# Altium schematic sheet MM32_Class_board_V2.0.SchDoc
size A3
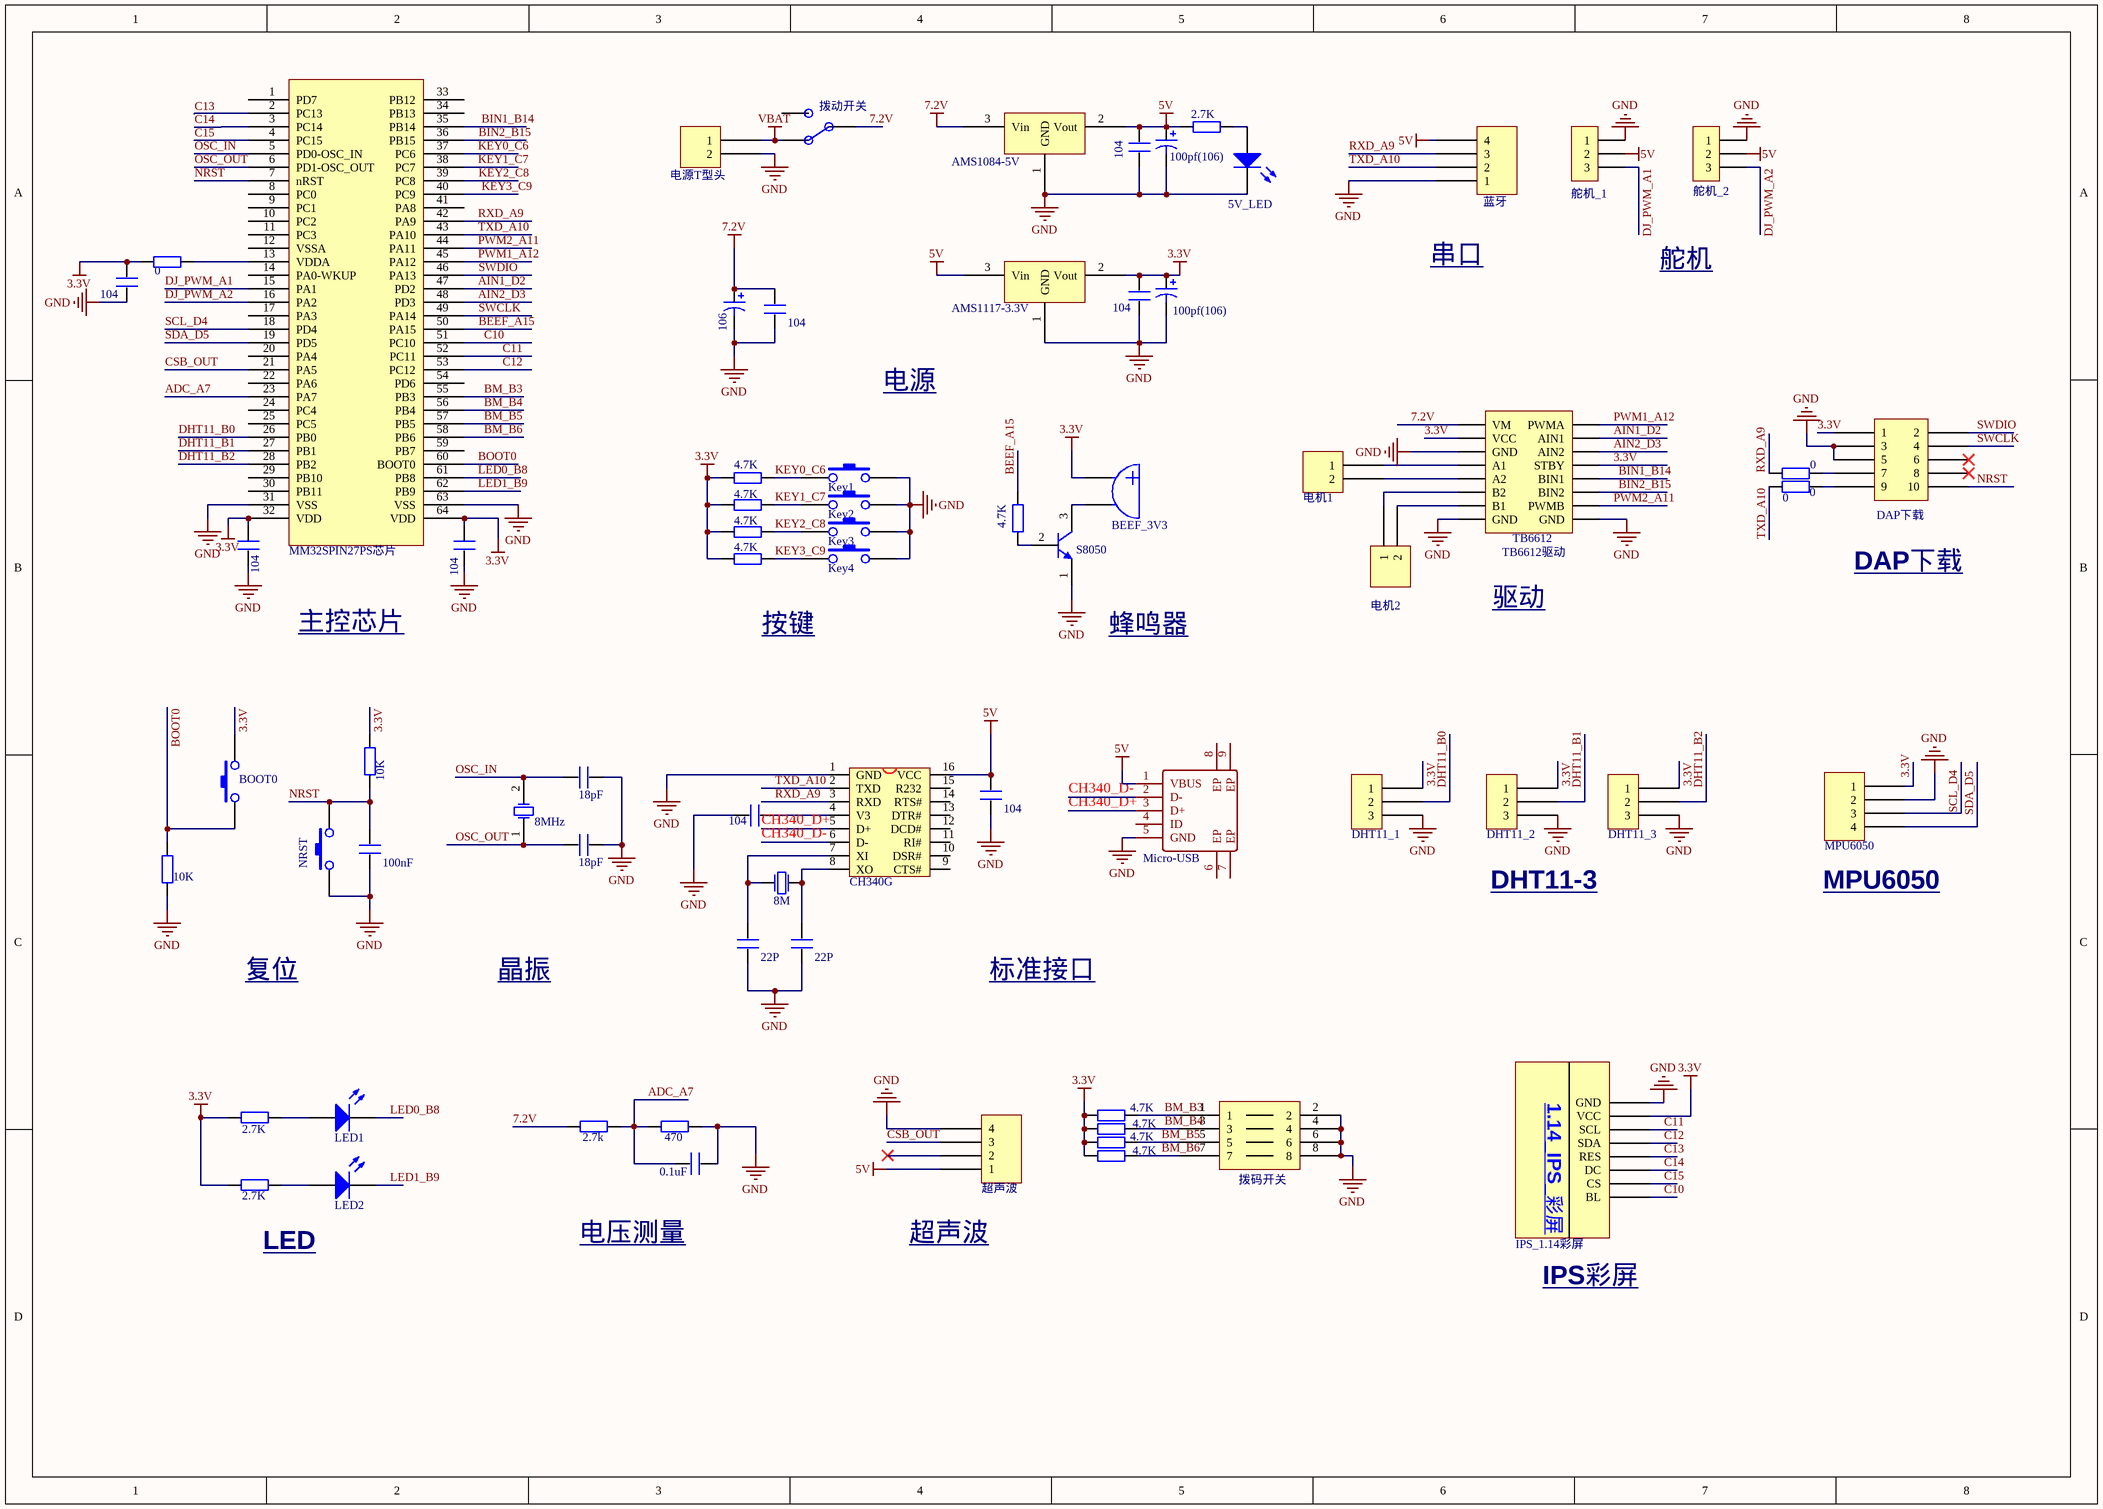
[diagram p0: MM32_Class_board_V2.0.SchDoc]

## Parts
6050  MPU6050  [四脚插座]
*1  IPS_1.14彩屏  [1.14_IPS]
A1  AMS1117-3.3V  [AMS1117]
A2  AMS1084-5V  [AMS1086]
B1  BEEF_3V3  [BEEF_3V3]
BOOT0  BOOT0  [贴片按键]
C1  104  [电容0805]
C2  100pf(106)  [钽电容1206]
C3  104  [电容0805]
C4  104  [电容0805]
C5  100pf(106)  [钽电容1206]
C6  106  [钽电容1206]
C7  104  [电容0805]
C8  104  [电容0805]
C9  104  [电容0805]
C10  18pF  [电容0805]
C11  104  [电容0805]
C12  104  [电容0805]
C13  18pF  [电容0805]
C15  22P  [电容0805]
C16  22P  [电容0805]
C17  0.1uF  [电容0805]
D1  5V_LED  [LED贴片]
D2  LED1  [LED贴片]
D3  LED2  [LED贴片]
DAP下载  DAP下载  [P5X2]
K_C6  Key1  [贴片按键]
K_C7  Key2  [贴片按键]
K_C8  Key3  [贴片按键]
K_C9  Key4  [贴片按键]
M1  Micro-USB  [Micro-USB]
OS1  8M  [晶振]
P4  DHT11_1  [三脚插座]
P5  DHT11_2  [三脚插座]
P6  DHT11_3  [三脚插座]
PA1  电机1  [电源插座1]
PA2  电机2  [电源插座1]
PB1  电源T型头  [电源插座2]
Q1  S8050  [NPN8050]
R1  2.7K  [电阻0805]
R2  0  [电阻0805]
R3  4.7K  [电阻0805]
R4  4.7K  [电阻0805]
R5  4.7K  [电阻0805]
R6  4.7K  [电阻0805]
R7  4.7K  [电阻0805]
R8  10K  [电阻0805]
R9  10K  [电阻0805]
R10  0  [电阻0805]
R11  0  [电阻0805]
R12  2.7K  [电阻0805]
R13  2.7k  [电阻0805]
R14  470  [电阻0805]
R15  2.7K  [电阻0805]
R16  4.7K  [电阻0805]
R17  4.7K  [电阻0805]
R18  4.7K  [电阻0805]
R19  4.7K  [电阻0805]
RESET  100nF  [电容0805]
S1  拨动开关  [拨动开关直插]
S7  NRST  [贴片按键]
U1  MM32SPIN27PS芯片  [LQFP-64_L10.0-W10.0-P0.50-LS12.0-BL]
U2  TB6612驱动  [6612pcb]
U3  CH340G  [CH340G]
Y1  8MHz  [晶振]
串口  蓝牙  [四脚插座]
拨码开关  拨码开关  [拨码开关]
舵机1  舵机_1  [P3]
舵机2  舵机_2  [P3]
超声波  超声波  [四脚插座]

## Nets
3.3V: 6050.1 *1.2(VCC) A1.2(Vout) B1.1(A) BOOT0.2 C3.2 C4.2 C5.1 C8.2 C9.2 DAP下载.1 P4.1 P5.1 P6.1 R2.1 R3.1 R4.1 R6.1 R7.1 R8.2 R12.1 R15.1 R16.1 R17.1 R18.1 R19.1 U1.32(VDD) U1.64(VDD) U2.2(VCC) U2.12(STBY)
5V: A1.3(Vin) A2.2(Vout) C1.2 C2.1 C12.2 M1.1(VBUS) R1.1 U3.16(VCC) 串口.4 舵机1.2 舵机2.2 超声波.1
7.2V: A2.3(Vin) C6.1 C7.2 R13.1 S1.2 U2.1(VM)
GND: 6050.2 *1.1(GND) A1.1(GND) A2.1(GND) C1.1 C2.2 C3.1 C4.1 C5.2 C6.2 C7.1 C8.1 C9.1 C10.2 C11.1 C12.1 C13.1 C15.1 C16.1 C17.2 D1.2(K) DAP下载.3 DAP下载.5 K_C6.2 K_C7.2 K_C8.2 K_C9.2 M1.5(GND) P4.3 P5.3 P6.3 PB1.2 Q1.1(E) R9.1 R14.2 RESET.1 S7.1 U1.31(VSS) U1.63(VSS) U2.3(GND) U2.8(GND) U2.16(GND) U3.1(GND) 串口.1 拨码开关.2 拨码开关.4 拨码开关.6 拨码开关.8 舵机1.1 舵机2.1 超声波.4
VBAT: PB1.1 S1.1
ADC_A7: C17.1 R13.2 R14.1 U1.23(PA7)
AIN1_D2: U1.47(PD2) U2.10(AIN1)
AIN2_D3: U1.48(PD3) U2.11(AIN2)
BEEF_A15: R5.1 U1.50(PA15)
BIN1_B14: U1.35(PB14) U2.13(BIN1)
BIN2_B15: U1.36(PB15) U2.14(BIN2)
BM_B3: R16.2 U1.55(PB3) 拨码开关.1
BM_B4: R17.2 U1.56(PB4) 拨码开关.3
BM_B5: R18.2 U1.57(PB5) 拨码开关.5
BM_B6: R19.2 U1.58(PB6) 拨码开关.7
BOOT0: BOOT0.1 R9.2 U1.60(BOOT0)
C10: *1.8(BL) U1.51(PC10)
C11: *1.3(SCL) U1.52(PC11)
C12: *1.4(SDA) U1.53(PC12)
C13: *1.5(RES) U1.2(PC13)
C14: *1.6(DC) U1.3(PC14)
C15: *1.7(CS) U1.4(PC15)
CH340_D+: M1.3(D+) U3.5(D+)
CH340_D-: M1.2(D-) U3.6(D-)
CSB_OUT: U1.21(PA5) 超声波.3
DHT11_B0: P4.2 U1.26(PB0)
DHT11_B1: P5.2 U1.27(PB1)
DHT11_B2: P6.2 U1.28(PB2)
DJ_PWM_A1: U1.15(PA1) 舵机1.3
DJ_PWM_A2: U1.16(PA2) 舵机2.3
KEY0_C6: K_C6.1 R3.2 U1.37(PC6)
KEY1_C7: K_C7.1 R4.2 U1.38(PC7)
KEY2_C8: K_C8.1 R6.2 U1.39(PC8)
KEY3_C9: K_C9.1 R7.2 U1.40(PC9)
LED0_B8: D2.2(K) U1.61(PB8)
LED1_B9: D3.2(K) U1.62(PB9)
NRST: DAP下载.10 R8.1 RESET.2 S7.2 U1.7(nRST)
OSC_IN: C10.1 U1.5(PD0-OSC_IN) Y1.2(OSC2)
OSC_OUT: C13.2 U1.6(PD1-OSC_OUT) Y1.1(OSC1)
PWM1_A12: U1.45(PA12) U2.9(PWMA)
PWM2_A11: U1.44(PA11) U2.15(PWMB)
RXD_A9: R10.1 U1.42(PA9) U3.3(RXD) 串口.3
SCL_D4: 6050.3 U1.18(PD4)
SDA_D5: 6050.4 U1.19(PD5)
SWCLK: DAP下载.4 U1.49(PA14)
SWDIO: DAP下载.2 U1.46(PA13)
TXD_A10: R11.2 U1.43(PA10) U3.2(TXD) 串口.2
NetB1_2: B1.2(B) Q1.3(C)
NetC11_2: C11.2 U3.4(V3)
NetC15_2: C15.2 OS1.1(P1) U3.7(XI)
NetC16_2: C16.2 OS1.2(P2) U3.8(XO)
NetD1_1: D1.1(A) R1.2
NetD2_1: D2.1(A) R12.2
NetD3_1: D3.1(A) R15.2
NetDAP下载_7: DAP下载.7 R10.2
NetDAP下载_9: DAP下载.9 R11.1
NetPA1_1: PA1.1 U2.4(A1)
NetPA1_2: PA1.2 U2.5(A2)
NetPA2_1: PA2.1 U2.6(B2)
NetPA2_2: PA2.2 U2.7(B1)
NetQ1_2: Q1.2(B) R5.2
NetR2_2: R2.2 U1.13(VDDA)

Not connected (* = marked no-connect by the designer): DAP下载 6* 8*; M1 4(ID) 6(EP) 7(EP) 8(EP) 9(EP); S1 3; U1 1(PD7) 8(PC0) 9(PC1) 10(PC2) 11(PC3) 12(VSSA) 14(PA0-WKUP) 17(PA3) 20(PA4) 22(PA6) 24(PC4) 25(PC5) 29(PB10) 30(PB11) 33(PB12) 34(PB13) 41(PA8) 54(PD6) 59(PB7); U3 9(CTS#) 10(DSR#) 11(RI#) 12(DCD#) 13(DTR#) 14(RTS#) 15(R232); 超声波 2*

## Notes on the sheet
- 串口
- 舵机
- 电源
- DAP下载
- 主控芯片
- 按键
- 蜂鸣器
- 驱动
- DHT11-3
- (near 6050) MPU6050
- 复位
- 晶振
- 标准接口
- LED
- 电压测量
- 超声波
- IPS彩屏
- (in symbol IPS_1.14彩屏) 1.14_IPS_彩屏

## Library data of the parts
6050 超声波 = P4: 四脚插座
A1 = AMS1117
A2 = AMS1084: 5.0V
BOOT0 K_C6-K_C9 S7 = Key: 按键
C1 C3 C4 C7-C13 C15-C17 RESET = C电容: 贴片电容
C2 C6 = C极性电容: 钽电容; Published: 8-Jun-2000; LatestRevisionDate: 17-Jul-2002; LatestRevisionNote: Re-released for DXP Platform.; PackageReference: POLAR0.8; Publisher: Altium Limited
  C2: Value: 100PF(106)
  C6: Value: 106
C5 = C极性电容: 钽电容; Value: c; Published: 8-Jun-2000; LatestRevisionDate: 17-Jul-2002; LatestRevisionNote: Re-released for DXP Platform.; PackageReference: POLAR0.8; Publisher: Altium Limited
D1-D3 = LED: Typical RED, GREEN, YELLOW, AMBER GaAs LED; Published: 8-Jun-2000; LatestRevisionDate: 17-Jul-2002; LatestRevisionNote: Re-released for DXP Platform.; PackageDocument: Feb-2002; PackageReference: 3.2X1.6X1.1; Publisher: Altium Limited
DAP下载 = P5X2
M1 = Micro-USB: 链接：https://item.taobao.com/item.htm?_u=338ue8lj7060&id=619776041547
OS1 = 晶振: vaule: 8M
P4-P6 = P3: 三脚插座
PA1 PA2 = POWERA: 接线端子
PB1 = T型头: 电源插座B
Q1 = S8050: NPN三极管; Published: 8-Jun-2000; LatestRevisionDate: 15-Jan-2003; LatestRevisionNote: PCB Footprint 'BCY-W3/D4.7' replaced; DatasheetDocument: 1997; PackageDocument: Sep-1998; PackageReference: TO-92A; Publisher: Altium Limited; Code_JEDEC: TO-92A; ComponentLink1Description: Manufacturer Link; ComponentLink1URL: http://www.fairchildsemi.com/; ComponentLink2Description: Datasheet; ComponentLink2URL: http://www.fairchildsemi.com/ds/2N%2F2N3904.pdf
R1 R3-R7 R16-R19 = Res1: 贴片电阻; Published: 8-Jun-2000; LatestRevisionDate: 17-Jul-2002; LatestRevisionNote: Re-released for DXP Platform.; PackageReference: AXIAL-0.4; Publisher: Altium Limited
  R1: Value: 2.7K
  R3-R7 R16-R19: Value: 4.7K
R2 R8-R12 R15 = Res: 贴片电阻; Published: 8-Jun-2000; LatestRevisionDate: 17-Jul-2002; LatestRevisionNote: Re-released for DXP Platform.; PackageReference: AXIAL-0.4; Publisher: Altium Limited
  R2 R10 R11: Value: 0
  R8 R9: Value: 10K
  R12 R15: Value: 2.7K
R13 = Res: 贴片电阻; Value: 1K; Published: 8-Jun-2000; LatestRevisionDate: 17-Jul-2002; LatestRevisionNote: Re-released for DXP Platform.; PackageReference: AXIAL-0.4; Publisher: Altium Limited
R14 = Res: 10K; Value: 2K; Published: 8-Jun-2000; LatestRevisionDate: 17-Jul-2002; LatestRevisionNote: Re-released for DXP Platform.; PackageReference: AXIAL-0.4; Publisher: Altium Limited
U1 = MM32SPIN27PS: MM32SPIN27PS芯片封装
U2 = TB6612: 小型电机驱动
U3 = CH340G: USB2UART
Y1 = XTAL: 晶振; Published: 8-Jun-2000; LatestRevisionDate: 17-Jul-2002; LatestRevisionNote: Re-released for DXP Platform.; Publisher: Altium Limited
串口 = P4
舵机1 舵机2 = P3